# Altium schematic sheet MCU-power.SchDoc
size A
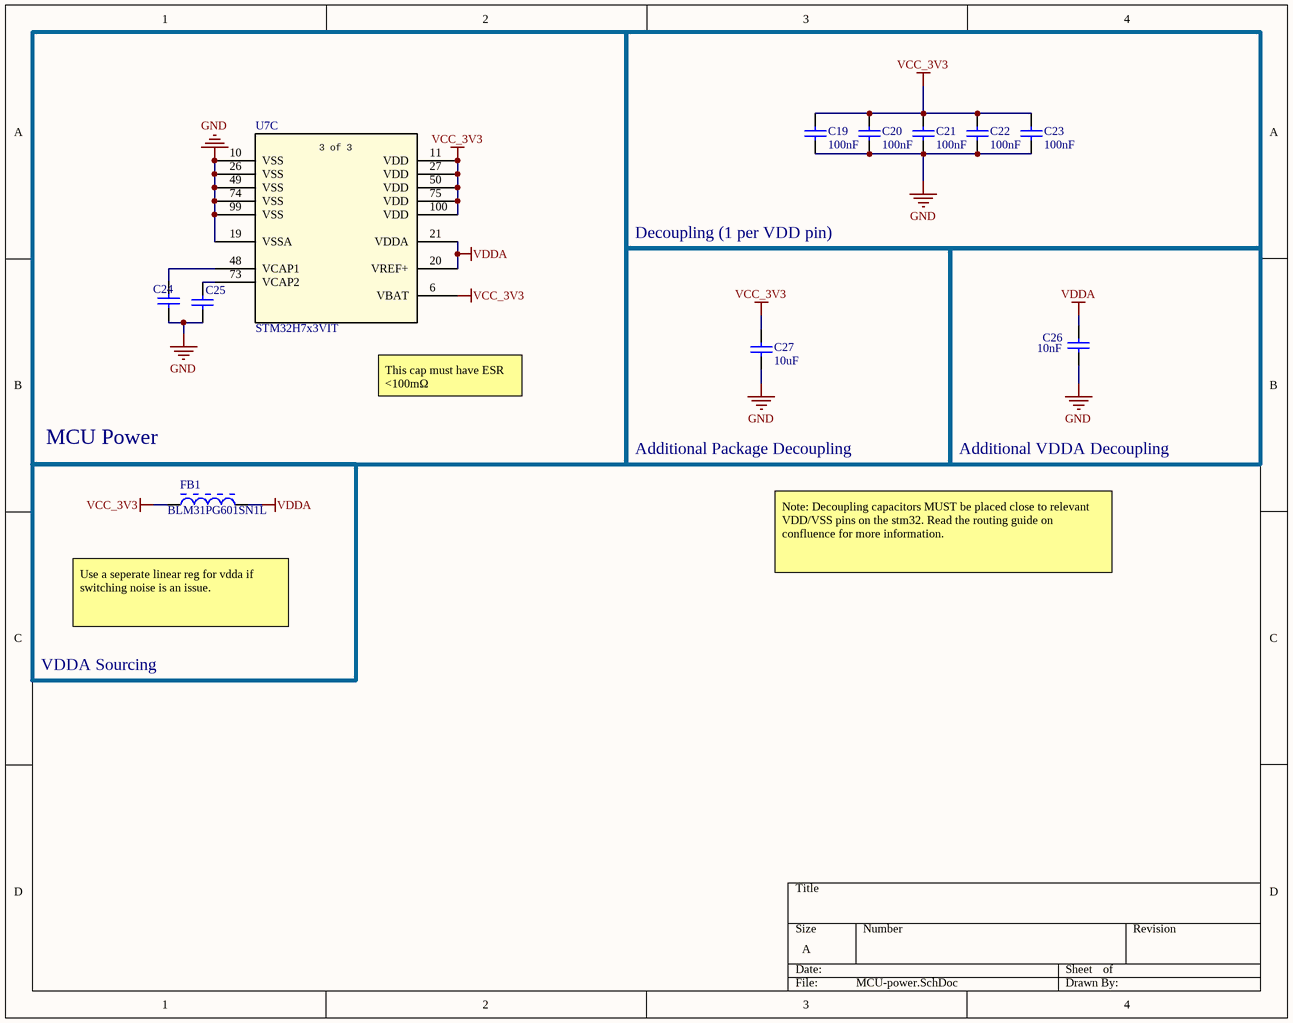
[diagram p0: MCU-power.SchDoc]

## Parts
C19  100nF  [CAPC0603(1608)100_N]
C20  100nF  [CAPC0603(1608)100_N]
C21  100nF  [CAPC0603(1608)100_N]
C22  100nF  [CAPC0603(1608)100_N]
C23  100nF  [CAPC0603(1608)100_N]
C24  CAP 2.2uF 10V 0603(1608)  [CAPC0603(1608)100_N]  (value not drawn)
C25  CAP 2.2uF 10V 0603(1608)  [CAPC0603(1608)100_N]  (value not drawn)
C26  10nF  [CAPC0603(1608)100_M]
C27  10uF  [CAPC0603(1608)100_N]
FB1  BLM31PG601SN1L  [MURA-BLM31-B-CHIP-2_V]
U7  STM32H7x3VIT  [LQFP100-14x14mm]  (part C of 3)

## Blocks framed on the sheet
Decoupling (1 per VDD pin): C19-C23
Additional VDDA Decoupling: C26
MCU Power: FB1

## Nets
GND: C19.1 C20.1 C21.1 C22.1 C23.1 C24.1 C25.1 C26.2 C27.1 U7.10(VSS) U7.19(VSSA) U7.26(VSS) U7.49(VSS) U7.74(VSS) U7.99(VSS)
VCC_3V3: C19.2 C20.2 C21.2 C22.2 C23.2 C27.2 FB1.1 U7.6(VBAT) U7.11(VDD) U7.27(VDD) U7.50(VDD) U7.75(VDD) U7.100(VDD)
VDDA: C26.1 FB1.2 U7.20(VREF+) U7.21(VDDA)
NetC24_2: C24.2 U7.48(VCAP1)
NetC25_2: C25.2 U7.73(VCAP2)

## Notes on the sheet
- This cap must have ESR <100mΩ
- Additional Package Decoupling
- Note: Decoupling capacitors MUST be placed close to relevant VDD/VSS pins on the stm32. Read the routing guide on confluence for more information.
- Use a seperate linear reg for vdda if switching noise is an issue.
- VDDA Sourcing
- (in symbol STM32H7x3VIT, part C) 3 of 3

## Library data of the parts
C19-C23 = CMP-1035-02580-1: CAP 100nF 10V ±10% 0603 (1608 Metric) Thickness 1mm SMD; Tolerance: Â±10%; Case-EIA: 0603; Case-Metric: 1608; Max Thickness: 1 mm; Value: 100nF; Rated Voltage: 10 V; Technology: SMT
C24 C25 = CMP-1035-02761-1: CAP 2.2uF 10V -20% to +80% 0603 (1608 Metric) Thickness 1mm SMD; Case-EIA: 0603; Case-Metric: 1608; Value: 2.2uF; Rated Voltage: 10 V; Tolerance: -20% to +80%; Max Thickness: 1 mm; Technology: SMT
C26 = CMP-1035-02306-1: CAP 10nF 10V ±10% 0603 (1608 Metric) Thickness 1mm SMD; Tolerance: Â±10%; Case-EIA: 0603; Case-Metric: 1608; Rated Voltage: 10 V; Value: 10nF; Technology: SMT; Max Thickness: 1 mm
C27 = CMP-1035-02799-1: CAP 10uF 10V ±10% 0603 (1608 Metric) Thickness 1mm SMD; Tolerance: Â±10%; Case-Metric: 1608; Case-EIA: 0603; Max Thickness: 1 mm; Technology: SMT; Rated Voltage: 10 V; Value: 10uF
FB1 = CMP-0686-00744-2: Chip Ferrite Bead for Power Lines, 600 Ohm, 1500 mA, -55 to 125 degC, 3.2 x 1.6 x 1.3 mm SMD, Tape and Reel; Manufacturer: Murata; DC Resistance: 0.08 Ohm Max.; Impedance (at 100 MHz): 600 Ohm +/- 25%; Rated Current: 1500 mA; ComponentLink1URL: http://www.murata.com/; ComponentLink3Description: Package Specification; DatasheetVersion: 08/2013; PartNumber: BLM31PG601SN1L; Mounting Technology: Surface Mount; ComponentLink3URL: http://www.murata.com/products/catalog/pdf/c31e.pdf; ComponentLink2Description: Datasheet; PackageDescription: 2-Pin Chip, Body 3.2 x 1.6 mm; Operating Temperature Range: -55 to 125 degC; ComponentLink1Description: Manufacturer URL; ComponentLink2URL: http://www.murata.com/products/catalog/pdf/c31e.pdf; PackageReference: BLM31-2; Packing: Tape and Reel
U7 = STM32H7x3VIT: Imported; Vendor: STMicroelectronics; Copyright: Copyright (C) 2016 Accelerated Designs. All rights reserved; Manufacturer_Part_Number: stm32h7x3vit; RefDes: RefDes; Type: DEV; Value: Value